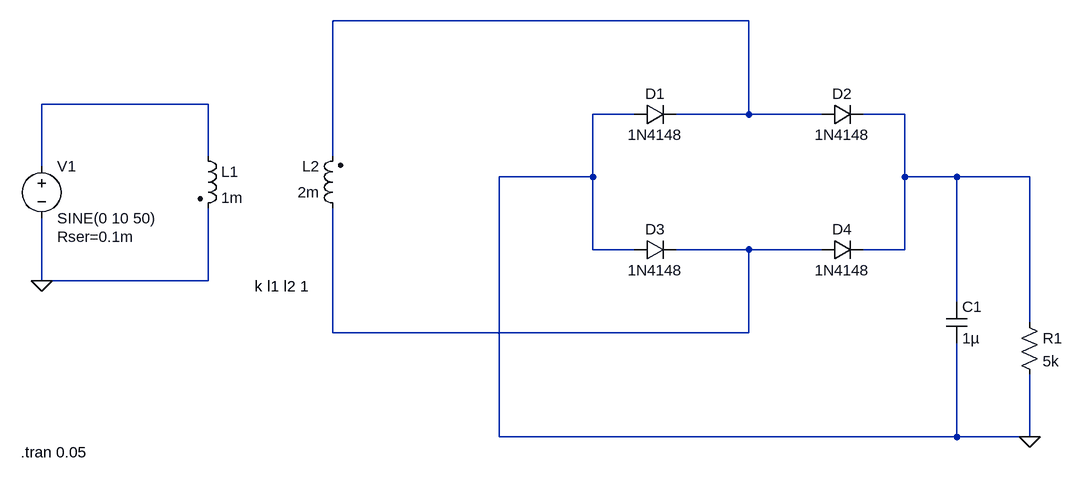
[diagram p0: schematic full-wave-filter.asc]
full-wave-filter.asc, the LTspice schematic file:
Version 4
SHEET 1 1128 680
WIRE 640 -112 0 -112
WIRE -192 16 -448 16
WIRE 464 32 400 32
WIRE 640 32 640 -112
WIRE 640 32 528 32
WIRE 752 32 640 32
WIRE 880 32 816 32
WIRE -192 96 -192 16
WIRE 0 96 0 -112
WIRE -448 112 -448 16
WIRE 400 128 400 32
WIRE 400 128 256 128
WIRE 880 128 880 32
WIRE 960 128 880 128
WIRE 1072 128 960 128
WIRE 400 240 400 128
WIRE 464 240 400 240
WIRE 640 240 528 240
WIRE 752 240 640 240
WIRE 880 240 880 128
WIRE 880 240 816 240
WIRE -448 288 -448 192
WIRE -192 288 -192 176
WIRE -192 288 -448 288
WIRE 960 320 960 128
WIRE 1072 352 1072 128
WIRE 0 368 0 176
WIRE 640 368 640 240
WIRE 640 368 0 368
WIRE 256 528 256 128
WIRE 960 528 960 384
WIRE 960 528 256 528
WIRE 1072 528 1072 432
WIRE 1072 528 960 528
FLAG 1072 528 0
FLAG -448 288 0
SYMBOL voltage -448 96 R0
WINDOW 123 0 0 Left 0
WINDOW 39 24 124 Left 2
SYMATTR SpiceLine Rser=0.1m
SYMATTR InstName V1
SYMATTR Value SINE(0 10 50)
SYMBOL ind2 -208 80 R0
SYMATTR InstName L1
SYMATTR Value 1m
SYMATTR Type ind
SYMBOL ind2 16 192 R180
WINDOW 0 36 80 Left 2
WINDOW 3 36 40 Left 2
SYMATTR InstName L2
SYMATTR Value 2m
SYMATTR Type ind
SYMBOL diode 464 48 R270
WINDOW 0 32 32 VTop 2
WINDOW 3 0 32 VBottom 2
SYMATTR InstName D1
SYMATTR Value 1N4148
SYMBOL diode 752 48 R270
WINDOW 0 32 32 VTop 2
WINDOW 3 0 32 VBottom 2
SYMATTR InstName D2
SYMATTR Value 1N4148
SYMBOL diode 464 256 R270
WINDOW 0 32 32 VTop 2
WINDOW 3 0 32 VBottom 2
SYMATTR InstName D3
SYMATTR Value 1N4148
SYMBOL diode 752 256 R270
WINDOW 0 32 32 VTop 2
WINDOW 3 0 32 VBottom 2
SYMATTR InstName D4
SYMATTR Value 1N4148
SYMBOL res 1056 336 R0
SYMATTR InstName R1
SYMATTR Value 5k
SYMBOL cap 944 320 R0
SYMATTR InstName C1
SYMATTR Value 1µ
TEXT -120 296 Left 2 !k l1 l2 1
TEXT -480 552 Left 2 !.tran 0.05

The netlist it stands for:
* full-wave-filter.asc
V1 N002 0 SINE(0 10 50) Rser=0.1m
L1 N002 0 1m
L2 N004 N001 2m
D1 0 N001 1N4148
D2 N001 N003 1N4148
D3 0 N004 1N4148
D4 N004 N003 1N4148
R1 N003 0 5k
C1 N003 0 1µ
.model D D
.lib standard.dio
k l1 l2 1
.tran 0.05
.backanno
.end